# EAGLE design m1-clock (EAGLE 9.6.0)
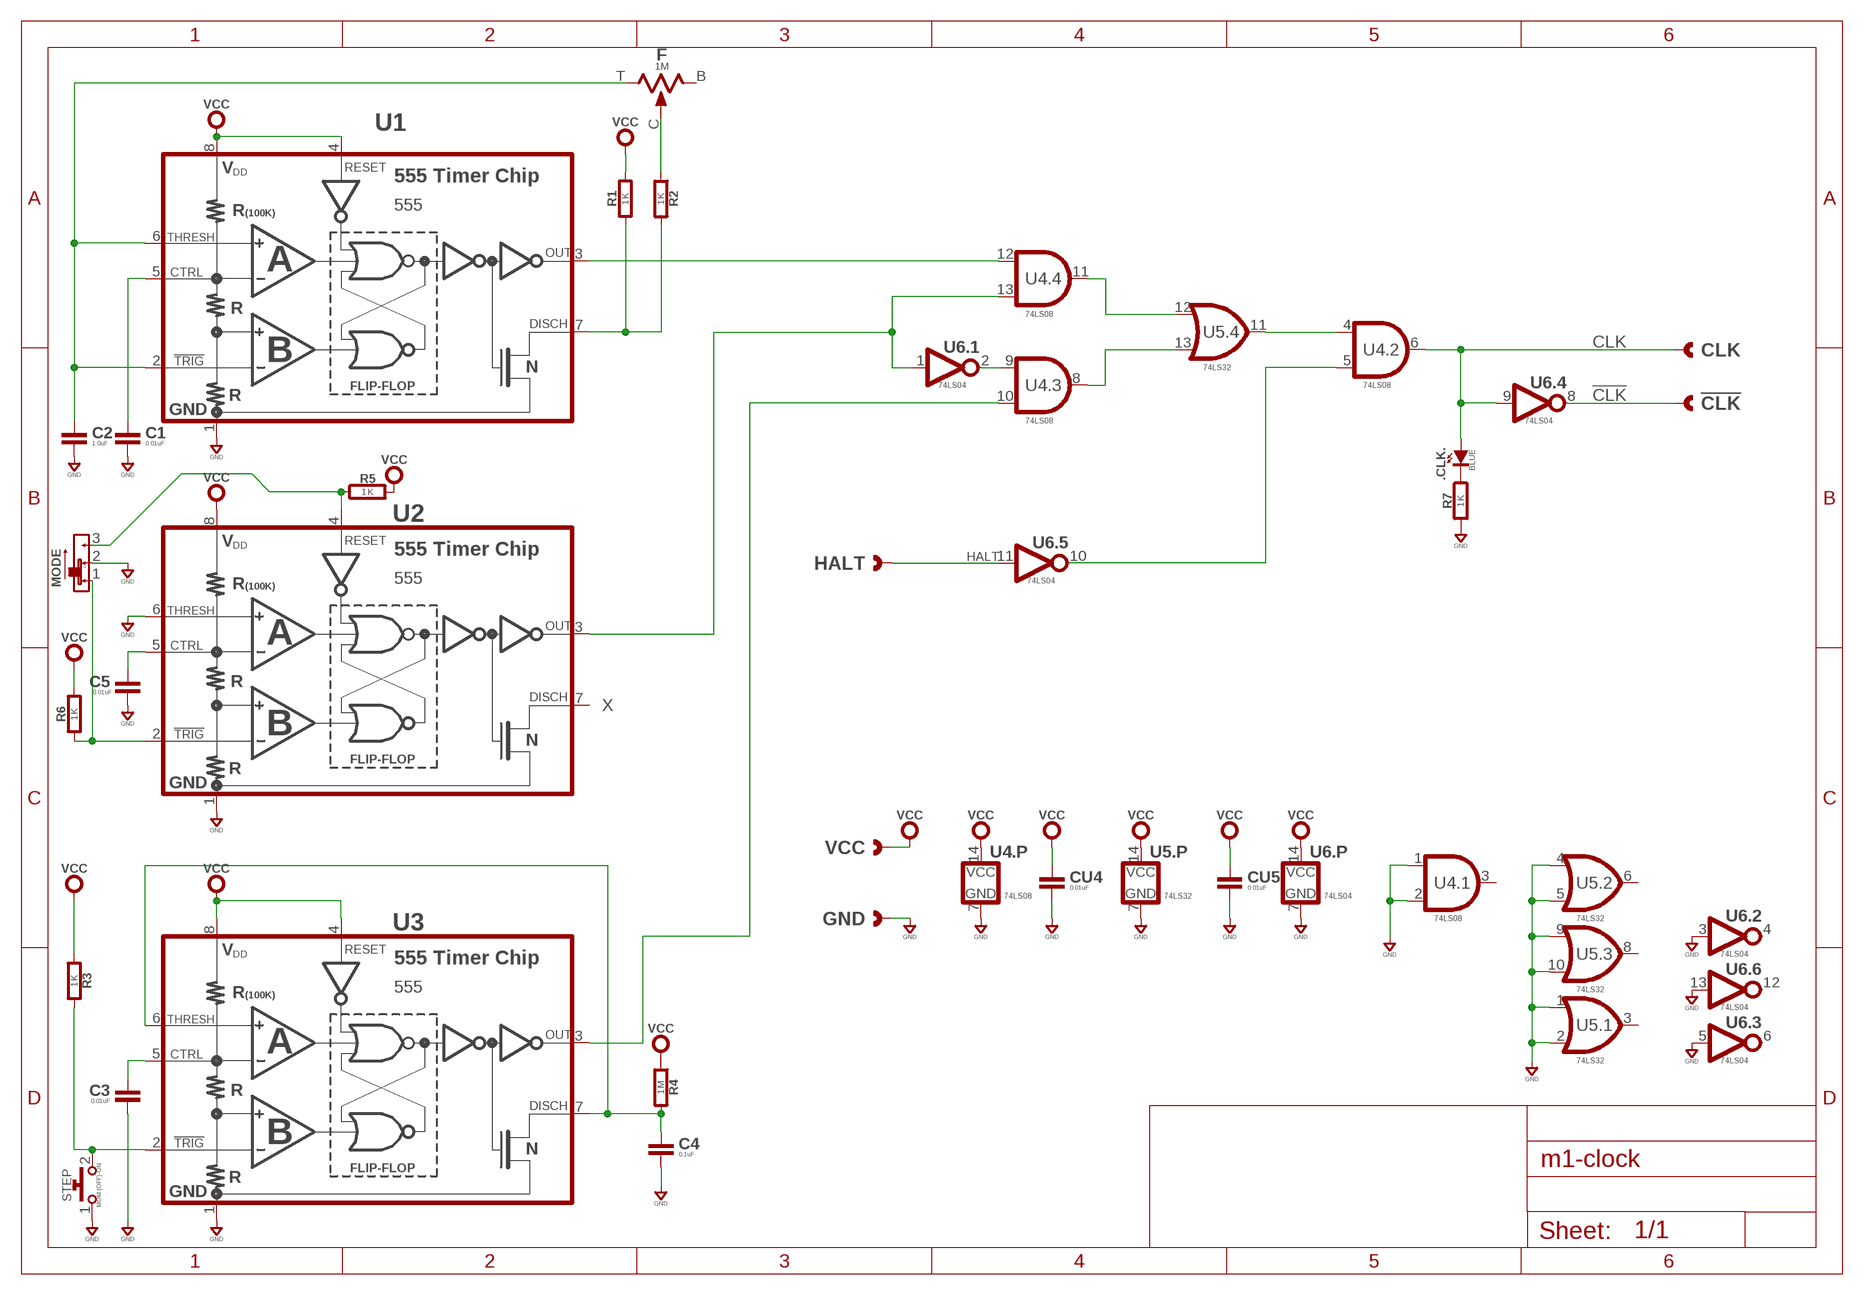
[diagram p0: schematic, sheet 1]

## Parts
!CLK  CAST-01X1  [CAST01-2.54MM]
.CLK.  BLUE  SMT0603  [SMD_0603]
C1  0.01uF  CAPACITOR0603  [0603-CAP]
C2  1.0uF  CAPACITOR0603  [0603-CAP]
C3  0.01uF  CAPACITOR0603  [0603-CAP]
C4  0.1uF  CAPACITOR0603  [0603-CAP]
C5  0.01uF  CAPACITOR0603  [0603-CAP]
CLK  CAST-01X1  [CAST01-2.54MM]
CU4  0.01uF  CAPACITOR0603  [0603-CAP]
CU5  0.01uF  CAPACITOR0603  [0603-CAP]
F  1M  TRIMPOTTC33X  [TRIM_BOURNS_TC33X]
GND  CAST-01X1  [CAST01-2.54MM]
HALT  CAST-01X1  [CAST01-2.54MM]
MODE  SLIDE-SPDTJS102011JCQN  [CK_JS102011JCQN]
R1  1K  RESISTOR0603  [0603-RES]
R2  1K  RESISTOR0603  [0603-RES]
R3  1K  RESISTOR0603  [0603-RES]
R4  1M  RESISTOR0603  [0603-RES]
R5  1K  RESISTOR0603  [0603-RES]
R6  1K  RESISTOR0603  [0603-RES]
R7  1K  RESISTOR0603  [0603-RES]
STEP  MOM (OFF)-ON  TACTILE-2PSMD  [SWITCH-0635-2P-SMD]
U1  555  555SOIC  [SOP08]
U2  555  555SOIC  [SOP08]
U3  555  555SOIC  [SOP08]
U4  74LS08  74LS08D  [SOP14]
U5  74LS32  74LS32D  [SOP14]
U6  74LS04  74LS04D  [SOP14]
VCC  CAST-01X1  [CAST01-2.54MM]

## Nets
!CLK: !CLK.1 U6.8(.4:Y)
CLK: .CLK..A CLK.1 U4.6(.2:Y) U6.9(.4:A)
GND: C1.2 C2.2 C3.2 C4.2 C5.2 CU4.2 CU5.2 GND.1 MODE.2 R7.2 STEP.1 U1.1(GND) U2.1(GND) U2.6(THRESHOLD) U3.1(GND) U4.1(.1:A) U4.2(.1:B) U4.7(.P:GND) U5.1(.1:A) U5.2(.1:B) U5.4(.2:A) U5.5(.2:B) U5.7(.P:GND) U5.9(.3:A) U5.10(.3:B) U6.3(.2:A) U6.5(.3:A) U6.7(.P:GND) U6.13(.6:A)
HALT: HALT.1 U6.11(.5:A)
N$1: C1.1 U1.5(CONTROL)
N$2: C2.1 F.T U1.2(TRIGGER#) U1.6(THRESHOLD)
N$3: U1.3(OUTPUT) U4.12(.4:A)
N$4: R1.1 R2.2 U1.7(DISCHARGE)
N$5: F.C R2.1
N$6: C3.1 U3.5(CONTROL)
N$7: R3.2 STEP.2 U3.2(TRIGGER#)
N$8: U3.3(OUTPUT) U4.10(.3:B)
N$9: MODE.3 R5.1 U2.4(RESET#)
N$10: C4.1 R4.2 U3.6(THRESHOLD) U3.7(DISCHARGE)
N$11: MODE.1 R6.1 U2.2(TRIGGER#)
N$12: C5.1 U2.5(CONTROL)
N$13: U4.9(.3:A) U6.2(.1:Y)
N$14: U2.3(OUTPUT) U4.13(.4:B) U6.1(.1:A)
N$15: U4.11(.4:Y) U5.12(.4:A)
N$16: U4.8(.3:Y) U5.13(.4:B)
N$17: U4.4(.2:A) U5.11(.4:Y)
N$18: U4.5(.2:B) U6.10(.5:Y)
N$21: .CLK..K(C) R7.1
VCC: CU4.1 CU5.1 R1.2 R3.1 R4.1 R5.2 R6.2 U1.4(RESET#) U1.8(VDD) U2.8(VDD) U3.4(RESET#) U3.8(VDD) U4.14(.P:VCC) U5.14(.P:VCC) U6.14(.P:VCC) VCC.1
Unconnected: F.B U2.7(DISCHARGE) U4.3(.1:Y) U5.3(.1:Y) U5.6(.2:Y) U5.8(.3:Y) U6.4(.2:Y) U6.6(.3:Y) U6.12(.6:Y)

## Notes on the sheet
- X

## Library data of the parts
!CLK CLK GND HALT VCC = con-headers:CAST-01X1: Castelated Edge Hole Pad
.CLK. = led:SMT: LED SMT
C1-C5 CU4 CU5 = rlc:CAPACITOR: Capacitor CAP
F = rlc:TRIMPOT: Trimpot, pot, potentiometer; VALUE: BOURNS TC33X
MODE = switch-smd:SLIDE-SPDT: Slide Switch - SPDT
R1-R7 = rlc:RESISTOR: Resistor
STEP = switch-smd:TACTILE-2P: Pushbutton Switch, 2 pin, SPST, PCB Mount, THD; MFR: CK Switch; MPN: PTS635S*SMTR; MPN2: Pololu #1400
U1-U3 = logic:555: 555 Timer Chip; MFR: TI; MPN: NE555PSR
U4 = logic:74*08?: 7408 Quad AND Gate
U5 = logic:74*32?: 7432 Quad XOR
U6 = logic:74*04?: Hex Inverter

## Board
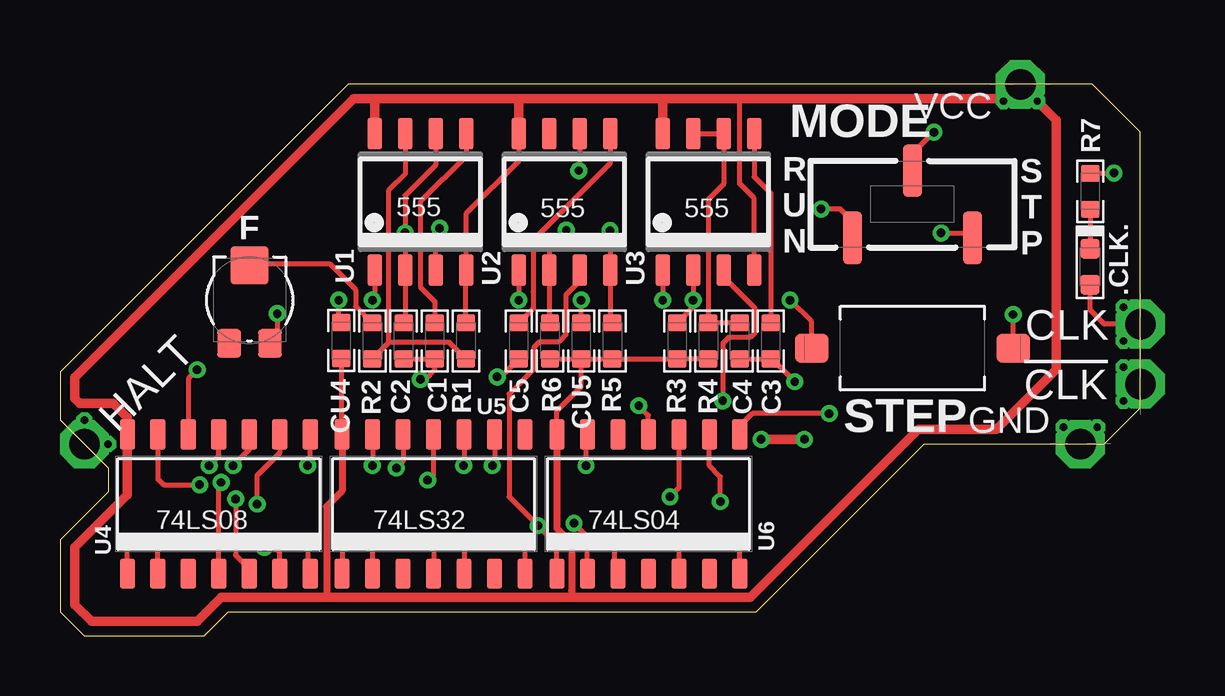
[diagram p1: board, top side]
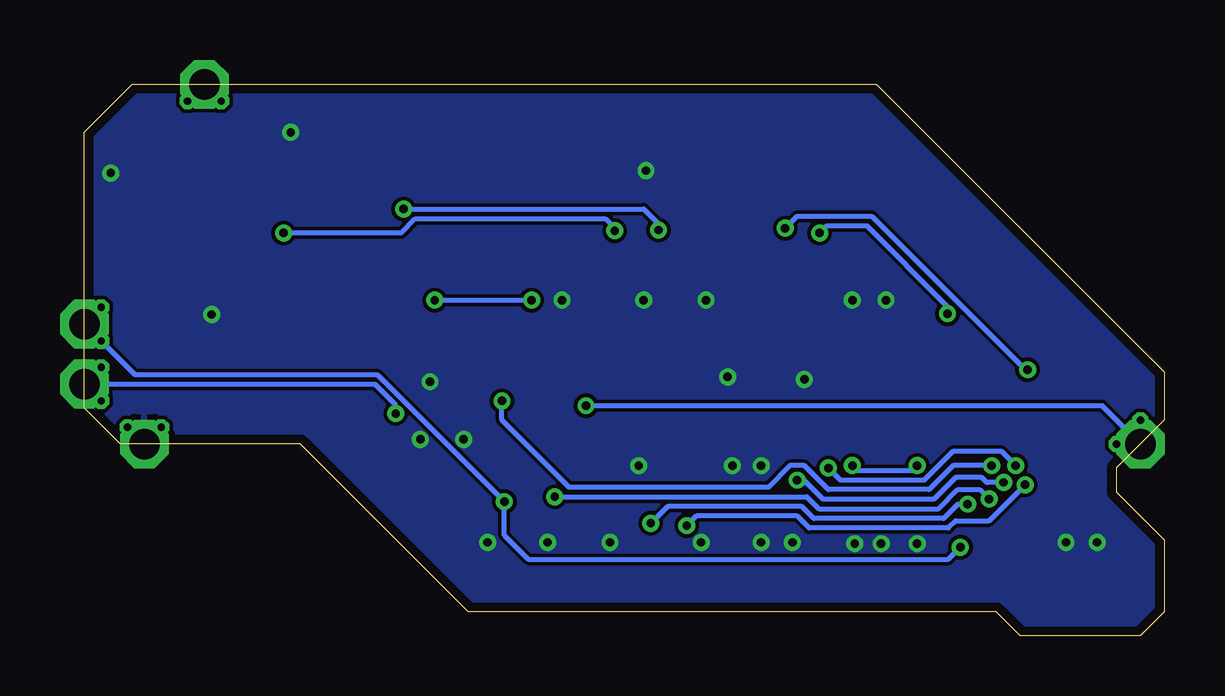
[diagram p2: board, bottom side, seen from below]

Size 45 x 23 mm. Coordinates in mm from the lower left corner, seen from the top.
Outline: 1,0 6,0 7,1 29,1 36,8 43.5,8 45,9.5 45,21 43,23 12,23 0,11 0,9 2,7 2,6 0,4 0,1 1,0
Copper layers (1*16): Top 0.0356mm / dielectric 1.5011mm / Bottom 0.0356mm
Design rules "OSH-CircuitMonkey *": minimum track width 6mil, minimum drill 12mil, track to track 6mil, track to pad 6mil, pad to pad 6mil, via to via 6mil, smd to smd 6mil, copper to edge 15mil, drill to drill 6mil, minimum pad ring 7mil, minimum via ring 7mil, stop-mask expansion 3mil, vias tented up to drill 14mil, thermal gap 10mil

### Footprints (pad centres in the part's own frame; a part is rotated, then mirrored left to right if it is on the bottom)
CAST01-2.54MM = drill 1.27 pad 2.032 octagon: 1 0,0 | drill 0.305 octagon: P$1 -0.7,0.7; P$2 -0.7,-0.7
SMD_0603 = smd 0.8 x 0.8: A 0.75,0; K -0.75,0
0603-CAP = smd 0.711 x 0.762: 1 -0.752,0; 2 0.752,0
TRIM_BOURNS_TC33X = smd 1 x 1.2: B -0.85,-1.8; T 0.85,-1.8 | smd 1.6 x 1.6: C 0,1.45
CK_JS102011JCQN = smd 0.8 x 2.2: 1 -2.5,-1.4; 2 0,1.4; 3 2.5,-1.4
0603-RES = smd 0.711 x 0.762: 1 -0.752,0; 2 0.752,0
SWITCH-0635-2P-SMD = smd 1.4 x 1.2: 1 -4.2,0; 2 4.2,0
SOP08 = smd 0.6 x 1.3: 1 -1.905,-2.85; 2 -0.635,-2.85; 3 0.635,-2.85; 4 1.905,-2.85; 5 1.905,2.85; 6 0.635,2.85; 7 -0.635,2.85; 8 -1.905,2.85
SOP14 = smd 1.27 x 0.635: 1 -2.9,3.81; 2 -2.9,2.54; 3 -2.9,1.27; 4 -2.9,0; 5 -2.9,-1.27; 6 -2.9,-2.54; 7 -2.9,-3.81; 8 2.9,-3.81; 9 2.9,-2.54; 10 2.9,-1.27; 11 2.9,0; 12 2.9,1.27; 13 2.9,2.54; 14 2.9,3.81

### Placement (x,y rotation side)
!CLK  45,10.5 0 top
.CLK.  42.9,15.4 270 top
C1  15.6,12.3 270 top
C2  14.3,12.3 270 top
C3  29.6,12.3 270 top
C4  28.3,12.3 270 top
C5  19.1,12.3 270 top
CLK  45,13 0 top
CU4  11.7,12.32 90 top
CU5  21.7,12.3 90 top
F  7.88,14 0 top
GND  42.5,8 270 top
HALT  1,8 225 top
MODE  35.5,18 0 top
R1  16.9,12.3 90 top
R2  13,12.3 270 top
R3  25.7,12.3 90 top
R4  27,12.3 90 top
R5  23,12.3 270 top
R6  20.4,12.3 270 top
R7  42.91,18.54 90 top
STEP  35.5,12 180 top
U1  15,18.1 0 top
U2  21,18.1 0 top
U3  27,18.1 0 top
U4  6.6,5.5 90 top
U5  15.55,5.5 90 top
U6  24.5,5.5 90 top
VCC  40,23 90 top

### Tracks (layer width: path | path; a pad name or v marks a point on that pad's centre or on a via)
!CLK  (via drill 0.35)
  Top 0.2: v32.03,9.27 28.83,9.27 28.31,8.75 U6.8
  Bottom 0.2: !CLK.1 32.9,10.5 32.03,9.63 v32.03,9.27
CLK  (via drill 0.35)
  Top 0.2: .CLK..A 42.9,13.6 43.5,13 CLK.1 | U4.6 9.14,3.46 8.9,3.7 v8.5,3.7 | v27.5,5.6 27.5,6.64 27.04,7.1 U6.9
  Bottom 0.2: v8.5,3.7 9,3.2 26.5,3.2 27.5,4.2 v27.5,5.6 32.8,10.9 42.9,10.9 CLK.1
GND  (via drill 0.35)
  Top 0.2: C4.2 C3.2 29.65,11.55 v30.6,10.6 | U3.1 v25.1,14 | U2.6 21.64,19.43 v21.6,19.4 | U2.1 v19.09,14.01 v19.1,14 | U1.1 13.1,14.01 v12.99,14.01 v13,14 | C2.2 C1.2 15.6,11.1 15.2,10.7 v15,10.7 | C5.2 18.35,10.8 v18.2,10.8 | MODE.2 35.5,20.1 v36.4,21 | R7.2 42.93,19.3 v43.9,19.3 | v10.3,3.85 10.3,2.71 U4.7 | v11.8,3.85 11.74,3.79 U5.1 | U5.2 13.01,3.74 v12.9,3.85 | U5.4 15.55,3.85 v15.5,3.9 | v16.8,3.9 16.82,3.88 U5.5 | U5.7 19.36,3.84 v19.3,3.9 | U6.3 23.1,2.73 v23.1,3.9 | v25.7,3.9 25.77,3.83 U6.5 | U6.7 28.31,3.79 v28.2,3.9 | U4.2 4.06,3.86 v4.1,3.9 | U4.1 v2.79,3.89 v2.8,3.9 | CU5.2 v21.7,14 | v16.8,7.1 16.82,7.12 U5.10 | U6.13 21.9,8.34 v21.9,7.1 | U5.9 18.09,7.19 v18,7.1 | STEP.1 v39.7,13.4 | CU4.2 11.6,13.17 v11.6,14
  Top 0.4: v29.2,8.2 v31,8.2
  pour Bottom (rank 5): 1,0 0,1 0,4 2,6 2,7 0,9 0,11 12,23 43,23 45,21 45,9.5 43.5,8 36,8 29,1 7,1 6,0
HALT  (via drill 0.35)
  Top 0.2: U6.11 24.5,9.2 v24.1,9.6
  Bottom 0.2: v24.1,9.6 2.6,9.6 HALT.1
N$1
  Top 0.2: U1.5 16.91,20 15,18.1 15,14.55 15.6,13.95 C1.1
N$2  (via drill 0.35)
  Top 0.2: U1.6 15.63,19.64 14.37,18.36 v14.37,16.8 U1.2 14.37,13.12 C2.1 | v9.04,13.44 9.04,12.51 F.T
  Bottom 0.2: v14.37,16.8 14.06,17.1 12.4,17.1 9.1,13.8 9.1,13.5 v9.04,13.44
N$3  (via drill 0.35)
  Top 0.2: U1.3 15.63,16.84 v15.8,17 | v5.7,11.1 5.33,10.73 U4.12
  Bottom 0.2: v15.8,17 15.3,17.5 12.2,17.5 5.8,11.1 v5.7,11.1
N$4
  Top 0.2: U1.7 14.37,19.27 13.67,18.57 13.67,12.33 13.69,12.31 13.69,12.24 | 13.69,12.24 16.21,12.24 R1.1 | R2.2 13.69,12.24
N$5
  Top 0.2: F.C 7.93,15.5 11.25,15.5 12.3,14.45 12.3,13.75 R2.1
N$6
  Top 0.2: U3.5 28.91,19.15 29.6,18.45 C3.1
N$7  (via drill 0.35)
  Top 0.2: U3.2 v26.36,14 26.36,13.72 R3.2 | STEP.2 31.3,13.1 v30.4,14
  Bottom 0.2: v30.4,14 v26.36,14
N$8  (via drill 0.35)
  Top 0.2: U3.3 27.64,14.96 28.93,13.67 28.93,12.63 28.74,12.44 27.84,12.44 27.6,12.2 27.6,12 27.63,11.97 27.63,11.13 27.6,11.1 v27.6,9.8 | U4.10 7.87,7.77 v7.2,7.1
  Bottom 0.2: v27.6,9.8 27.6,9 24.8,6.2 16.5,6.2 15.6,7.1 15,7.1 14,6.1 9.8,6.1 8.8,7.1 v7.2,7.1
N$9  (via drill 0.35)
  Top 0.2: R5.1 22.91,13.15 U2.4 v22.91,16.89 v22.9,16.89 | v36.7,16.8 37.8,16.8 MODE.3
  Bottom 0.2: v22.9,16.89 22.9,17 23.3,17.39 31.2,17.39 31.8,16.8 v36.7,16.8
N$10
  Top 0.2: U3.7 U3.6 27.64,18.84 27,18.2 R4.2 C4.1
N$11  (via drill 0.35)
  Top 0.2: R6.1 20.36,13.09 U2.2 20.36,16.21 v21.08,16.92 | MODE.1 33,17.3 32.5,17.8 v31.7,17.8
  Bottom 0.2: v31.7,17.8 21.7,17.8 21.08,17.18 v21.08,16.92
N$12
  Top 0.2: U2.5 22.91,19.7 19.7,16.5 19.7,14.36 19.7,14.35 19.7,13.65 C5.1
N$13  (via drill 0.35)
  Top 0.2: U6.2 21.96,4.14 v21.4,4.7 | U4.9 9.14,7.63 8.2,6.7 v8.2,5.5
  Bottom 0.2: v21.4,4.7 20.7,5.4 15.1,5.4 14.6,4.9 9.2,4.9 8.61,5.5 v8.2,5.5
N$14  (via drill 0.35)
  Top 0.2: U2.3 21.64,14.79 21.07,14.22 21.07,12.57 20.76,12.26 19.96,12.26 19.73,12.03 19.73,11.13 18.7,10.1 18.7,5.8 v19.9,4.6 20.69,3.81 U6.1 | U4.13 4.06,6.54 4.3,6.3 v5.8,6.3
  Bottom 0.2: v19.9,4.6 19.5,5 15.3,5 14.8,4.5 9,4.5 8.7,4.8 7.3,4.8 v5.8,6.3
N$15  (via drill 0.35)
  Top 0.2: U5.12 14.28,7.28 v14,7 | v6.2,7.1 6.6,7.5 U4.11
  Bottom 0.2: v14,7 13.5,6.5 10,6.5 8.79,7.71 6.8,7.71 v6.2,7.1
N$16  (via drill 0.35)
  Top 0.2: U5.13 v13.01,7.11 v13,7.11 | v10.3,7.11 10.41,7.21 U4.8
  Bottom 0.2: v13,7.11 12.79,6.9 10.5,6.9 v10.3,7.11
N$17  (via drill 0.35)
  Top 0.2: U4.4 6.6,6.3 v6.7,6.4 | v15.3,6.5 15.55,6.75 U5.11
  Bottom 0.2: v6.7,6.4 7.4,6.4 7.6,6.6 8.7,6.6 9.6,5.7 14.21,5.7 15,6.5 v15.3,6.5
N$18  (via drill 0.35)
  Top 0.2: v7.3,5.71 7.3,3.37 7.87,2.8 U4.5 | U6.10 25.77,6.17 v25.4,5.8
  Bottom 0.2: v7.3,5.71 7.4,5.8 7.41,5.8 7.7,6.1 8.6,6.1 9.4,5.3 14.4,5.3 14.9,5.8 v25.4,5.8
N$21
  Top 0.2: R7.1 42.91,16.16 .CLK..K
VCC
  Top 0.2: U2.8 19.09,19.8 16.9,17.6 U1.4 R1.2 | R6.2 CU5.1 | CU5.1 R5.2 R3.1 R4.1 | U3.4 28.91,18.25 28.3,18.86 28.3,22.4 | U6.14 20.69,9.39 21.7,10.4 CU5.1 | U5.14 11.7,8.44 CU4.1
  Top 0.3: U5.14 11.74,6.05 11.09,5.4 11.09,1.6 | U6.14 20.69,4.48 21.31,3.86 21.31,1.9 21.3,1.89 21.3,1.6
  Top 0.4: 19.1,22.4 13.1,22.4 13.1,22.39 | 19.1,22.4 25.1,22.4 | 25.1,22.4 28.3,22.4 39.4,22.4 VCC.1 41.5,21.5 41.5,11.1 39,8.6 35.75,8.6 28.75,1.6 21.3,1.6 11.09,1.6 6.7,1.6 5.7,0.6 1.3,0.6 0.6,1.3 0.6,3.7 2.79,5.89 U4.14 2.79,9.11 2.2,9.7 0.8,9.7 0.6,9.89 0.6,10.78 12.22,22.39 13.1,22.39 | U2.8 19.09,22.39 19.1,22.4 | U3.8 25.09,22.39 25.1,22.4 | U1.8 13.1,22.39

### Text on the board
tPlace: R / U / N | S / T / P
tDocu: Vcc | CLK | !CLK | HLT | GND